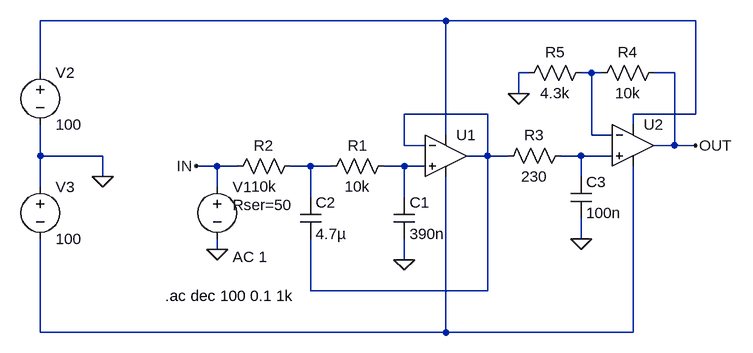
[diagram p0: schematic Draft2.asc]
Draft2.asc, the LTspice schematic file:
Version 4
SHEET 1 880 680
WIRE 160 -32 -464 -32
WIRE 544 -32 160 -32
WIRE -464 48 -464 -32
WIRE 288 48 272 48
WIRE 384 48 368 48
WIRE 400 48 384 48
WIRE 512 48 480 48
WIRE 272 80 272 48
WIRE 224 112 96 112
WIRE 544 112 544 -32
WIRE 544 112 448 112
WIRE 448 128 448 112
WIRE 160 144 160 -32
WIRE 384 144 384 48
WIRE 416 144 384 144
WIRE 96 160 96 112
WIRE 128 160 96 160
WIRE 512 160 512 48
WIRE 512 160 480 160
WIRE 544 160 512 160
WIRE -464 176 -464 128
WIRE -368 176 -464 176
WIRE 224 176 224 112
WIRE 224 176 192 176
WIRE 256 176 224 176
WIRE 368 176 336 176
WIRE 416 176 368 176
WIRE -192 192 -224 192
WIRE -160 192 -192 192
WIRE -48 192 -80 192
WIRE -16 192 -48 192
WIRE 96 192 64 192
WIRE 128 192 96 192
WIRE -368 208 -368 176
WIRE 368 208 368 176
WIRE -464 224 -464 176
WIRE -192 224 -192 192
WIRE -48 240 -48 192
WIRE 96 240 96 192
WIRE 368 304 368 272
WIRE -192 320 -192 304
WIRE 96 336 96 304
WIRE -48 384 -48 304
WIRE 224 384 224 176
WIRE 224 384 -48 384
WIRE -464 448 -464 304
WIRE 160 448 160 208
WIRE 160 448 -464 448
WIRE 448 448 448 192
WIRE 448 448 160 448
FLAG 96 336 0
FLAG -192 320 0
FLAG -224 192 IN
FLAG 544 160 OUT
FLAG 272 80 0
FLAG 368 304 0
FLAG -368 208 0
SYMBOL OpAmps\\UniversalOpAmp2 160 176 R0
SYMATTR InstName U1
SYMBOL res 80 176 R90
WINDOW 0 0 56 VBottom 2
WINDOW 3 32 56 VTop 2
SYMATTR InstName R1
SYMATTR Value 10k
SYMBOL res -64 176 R90
WINDOW 0 0 56 VBottom 2
WINDOW 3 32 56 VTop 2
SYMATTR InstName R2
SYMATTR Value 10k
SYMBOL cap 80 240 R0
SYMATTR InstName C1
SYMATTR Value 390n
SYMBOL cap -64 240 R0
SYMATTR InstName C2
SYMATTR Value 4.7µ
SYMBOL voltage -192 208 R0
WINDOW 123 24 124 Left 2
WINDOW 39 24 44 Left 2
SYMATTR Value2 AC 1
SYMATTR SpiceLine Rser=50
SYMATTR InstName V1
SYMATTR Value ""
SYMBOL cap 352 208 R0
SYMATTR InstName C3
SYMATTR Value 100n
SYMBOL res 352 160 R90
WINDOW 0 0 56 VBottom 2
WINDOW 3 32 56 VTop 2
SYMATTR InstName R3
SYMATTR Value 230
SYMBOL OpAmps\\UniversalOpAmp2 448 160 R0
SYMATTR InstName U2
SYMBOL res 496 32 R90
WINDOW 0 0 56 VBottom 2
WINDOW 3 32 56 VTop 2
SYMATTR InstName R4
SYMATTR Value 10k
SYMBOL res 272 64 R270
WINDOW 0 32 56 VTop 2
WINDOW 3 0 56 VBottom 2
SYMATTR InstName R5
SYMATTR Value 4.3k
SYMBOL voltage -464 32 R0
WINDOW 123 0 0 Left 0
WINDOW 39 0 0 Left 0
SYMATTR InstName V2
SYMATTR Value 100
SYMBOL voltage -464 208 R0
WINDOW 123 0 0 Left 0
WINDOW 39 0 0 Left 0
SYMATTR InstName V3
SYMATTR Value 100
TEXT -272 392 Left 2 !.ac dec 100 0.1 1k

The netlist it stands for:
* Draft2.asc
XU1 N006 N003 N001 N007 N003 level2 Avol=1Meg GBW=10Meg Slew=10Meg Ilimit=25m Rail=0 Vos=0 En=0 Enk=0 In=0 Ink=0 Rin=500Meg  ; pins In+ In- V+ V- OUT
R1 N006 N005 10k
R2 N005 IN 10k
C1 N006 0 390n
C2 N005 N003 4.7µ
V1 IN 0 AC 1 Rser=50
C3 N004 0 100n
R3 N004 N003 230
XU2 N004 N002 N001 N007 OUT level2 Avol=1Meg GBW=10Meg Slew=10Meg Ilimit=25m Rail=0 Vos=0 En=0 Enk=0 In=0 Ink=0 Rin=500Meg  ; pins In+ In- V+ V- OUT
R4 OUT N002 10k
R5 0 N002 4.3k
V2 N001 0 100
V3 0 N007 100
.ac dec 100 0.1 1k
.lib UniversalOpAmp2.lib
.backanno
.end